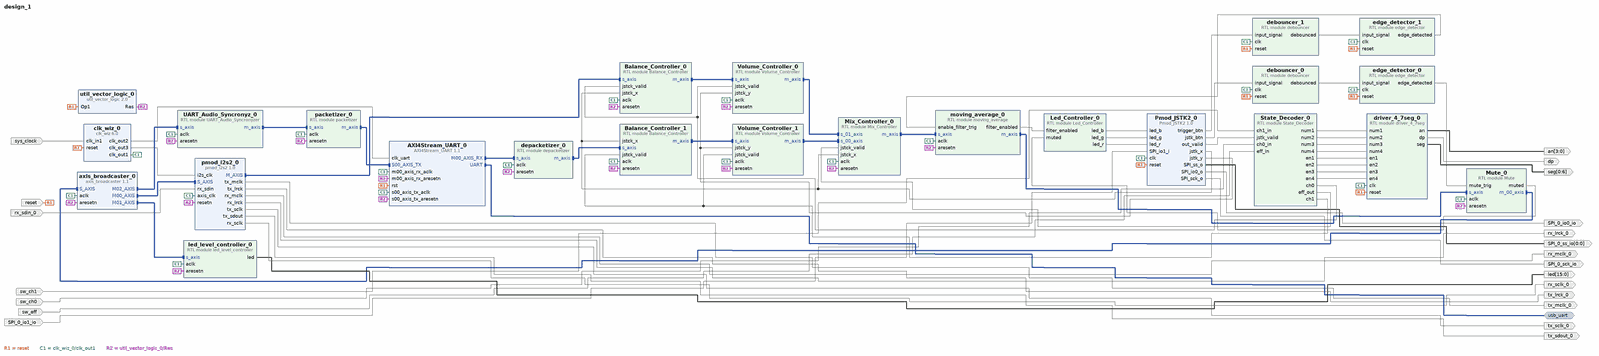
[diagram p0: block diagram of the top level, whole]
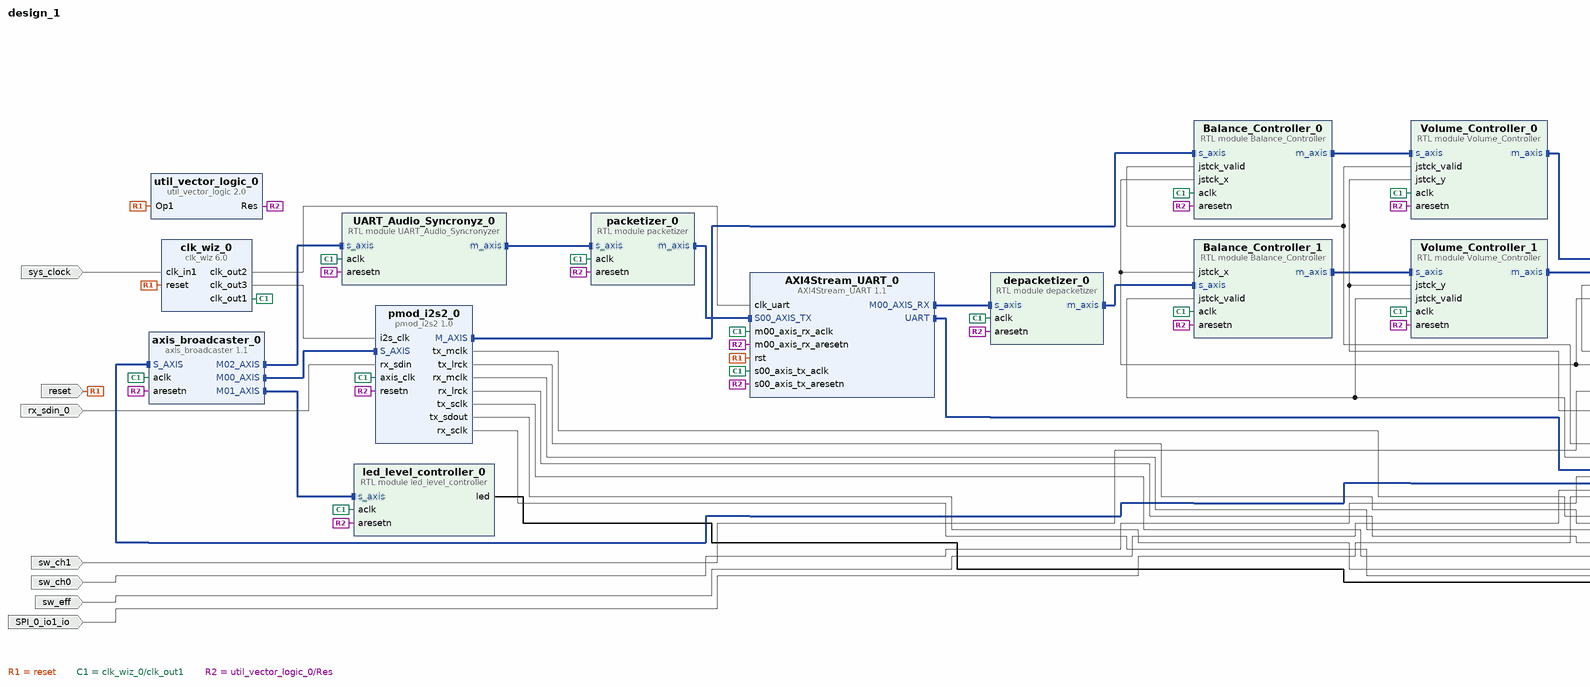
[diagram p1: block diagram of the top level, left part]
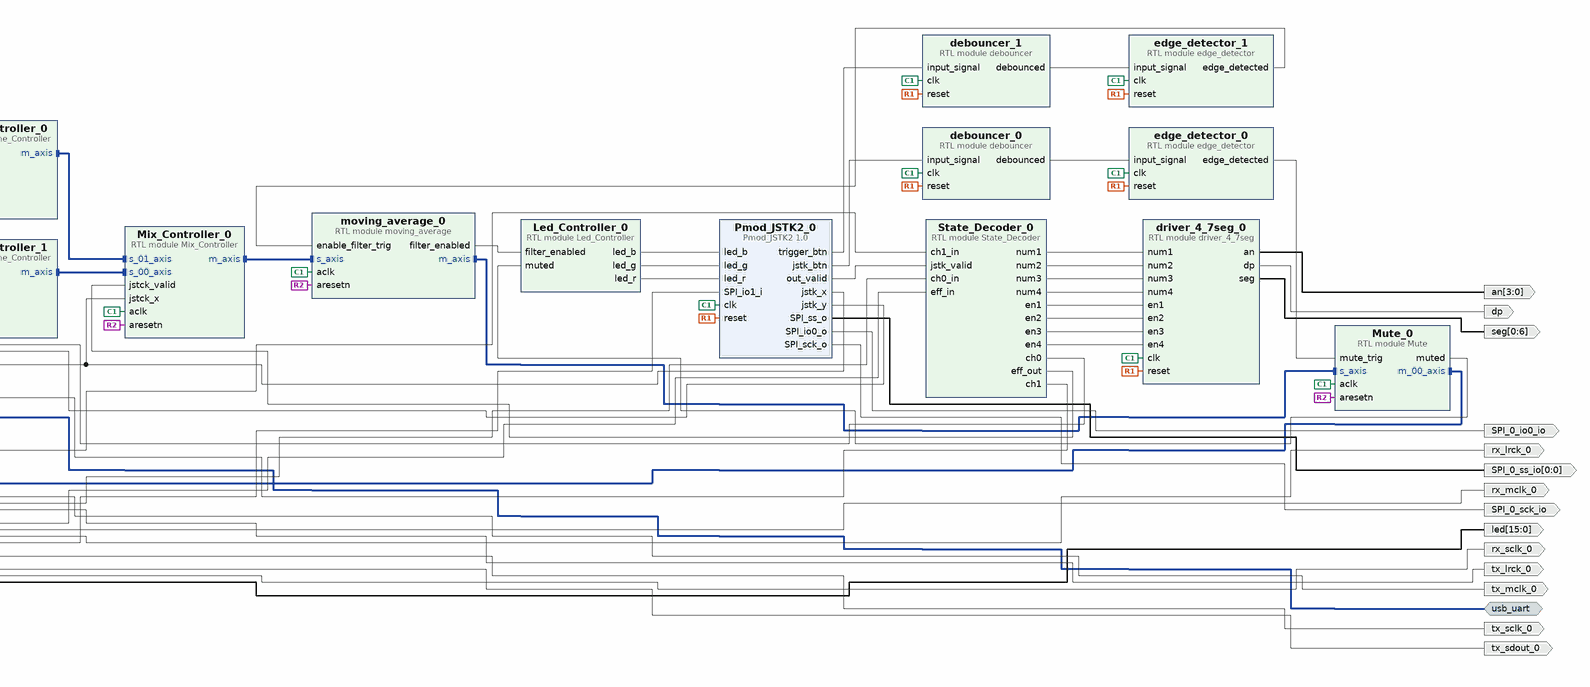
[diagram p2: block diagram of the top level, right part]
# Vivado block design design_1, xc7a35tcpg236-1, Vivado 2020.2
create_bd_design design_1

create_bd_intf_port -mode Master -vlnv xilinx.com:interface:uart_rtl:1.0 usb_uart
create_bd_port -dir I -type clk sys_clock
set_property -dict {CONFIG.FREQ_HZ 100000000 CONFIG.PHASE 0.000} [get_bd_ports sys_clock]
create_bd_port -dir I -type rst reset
set_property -dict {CONFIG.POLARITY ACTIVE_HIGH} [get_bd_ports reset]
create_bd_port -dir I sw_ch1
create_bd_port -dir I sw_ch0
create_bd_port -dir I sw_eff
create_bd_port -dir O -from 0 -to 6 seg
create_bd_port -dir O -from 3 -to 0 an
create_bd_port -dir O dp
create_bd_port -dir O tx_mclk_0
create_bd_port -dir O tx_lrck_0
create_bd_port -dir O rx_mclk_0
create_bd_port -dir O rx_lrck_0
create_bd_port -dir O tx_sclk_0
create_bd_port -dir O tx_sdout_0
create_bd_port -dir O rx_sclk_0
create_bd_port -dir O -from 15 -to 0 led
create_bd_port -dir I rx_sdin_0
create_bd_port -dir O -from 0 -to 0 SPI_0_ss_io
create_bd_port -dir O SPI_0_io0_io
create_bd_port -dir O SPI_0_sck_io
create_bd_port -dir I SPI_0_io1_io

create_bd_cell -type ip -vlnv xilinx.com:ip:clk_wiz:6.0 clk_wiz_0
set_property -dict [list \
  CONFIG.CLKOUT1_JITTER 144.719 \
  CONFIG.CLKOUT1_PHASE_ERROR 114.212 \
  CONFIG.CLKOUT2_JITTER 182.553 \
  CONFIG.CLKOUT2_PHASE_ERROR 114.212 \
  CONFIG.CLKOUT2_REQUESTED_OUT_FREQ 32.000 \
  CONFIG.CLKOUT2_USED true \
  CONFIG.CLKOUT3_JITTER 195.115 \
  CONFIG.CLKOUT3_PHASE_ERROR 114.212 \
  CONFIG.CLKOUT3_REQUESTED_OUT_FREQ 22.591 \
  CONFIG.CLKOUT3_USED true \
  CONFIG.CLK_IN1_BOARD_INTERFACE sys_clock \
  CONFIG.MMCM_CLKFBOUT_MULT_F 8.000 \
  CONFIG.MMCM_CLKOUT0_DIVIDE_F 8.000 \
  CONFIG.MMCM_CLKOUT1_DIVIDE 25 \
  CONFIG.MMCM_CLKOUT2_DIVIDE 35 \
  CONFIG.NUM_OUT_CLKS 3 \
  CONFIG.RESET_BOARD_INTERFACE reset \
  CONFIG.USE_BOARD_FLOW true \
  CONFIG.USE_LOCKED false \
] [get_bd_cells clk_wiz_0]
create_bd_cell -type ip -vlnv xilinx.com:ip:util_vector_logic:2.0 util_vector_logic_0
set_property -dict {CONFIG.C_OPERATION not CONFIG.C_SIZE 1} [get_bd_cells util_vector_logic_0]
create_bd_cell -type module -reference Led_Controller Led_Controller_0
create_bd_cell -type ip -vlnv TimeEngineers:ip:Pmod_JSTK2:1.0 Pmod_JSTK2_0
create_bd_cell -type module -reference moving_average moving_average_0
create_bd_cell -type module -reference edge_detector edge_detector_0
create_bd_cell -type module -reference edge_detector edge_detector_1
create_bd_cell -type module -reference debouncer debouncer_0
create_bd_cell -type module -reference debouncer debouncer_1
create_bd_cell -type module -reference Volume_Controller Volume_Controller_0
create_bd_cell -type module -reference Volume_Controller Volume_Controller_1
create_bd_cell -type module -reference UART_Audio_Syncronyzer UART_Audio_Syncronyz_0
create_bd_cell -type module -reference Mute Mute_0
create_bd_cell -type ip -vlnv xilinx.com:ip:axis_broadcaster:1.1 axis_broadcaster_0
set_property -dict {CONFIG.M02_TDATA_REMAP {tdata[23:0]} CONFIG.NUM_MI 3} [get_bd_cells axis_broadcaster_0]
create_bd_cell -type ip -vlnv DigiLAB:ip:AXI4Stream_UART:1.1 AXI4Stream_UART_0
set_property -dict [list \
  CONFIG.UART_BAUD_RATE 2000000 \
  CONFIG.UART_BOARD_INTERFACE usb_uart \
  CONFIG.USE_BOARD_FLOW true \
] [get_bd_cells AXI4Stream_UART_0]
create_bd_cell -type ip -vlnv TimeEngineers:ip:pmod_i2s2:1.0 pmod_i2s2_0
create_bd_cell -type module -reference Balance_Controller Balance_Controller_0
create_bd_cell -type module -reference Balance_Controller Balance_Controller_1
create_bd_cell -type module -reference packetizer packetizer_0
create_bd_cell -type module -reference depacketizer depacketizer_0
create_bd_cell -type module -reference Mix_Controller Mix_Controller_0
create_bd_cell -type module -reference State_Decoder State_Decoder_0
create_bd_cell -type module -reference driver_4_7seg driver_4_7seg_0
create_bd_cell -type module -reference led_level_controller led_level_controller_0

# ---- connections ----

connect_bd_intf_net [get_bd_intf_pins depacketizer_0/m_axis] [get_bd_intf_pins Balance_Controller_1/s_axis]
connect_bd_intf_net [get_bd_intf_pins Volume_Controller_1/s_axis] [get_bd_intf_pins Balance_Controller_1/m_axis]
connect_bd_intf_net [get_bd_intf_pins Volume_Controller_0/s_axis] [get_bd_intf_pins Balance_Controller_0/m_axis]
connect_bd_intf_net [get_bd_intf_pins pmod_i2s2_0/S_AXIS] [get_bd_intf_pins axis_broadcaster_0/M00_AXIS]
connect_bd_intf_net [get_bd_intf_pins pmod_i2s2_0/M_AXIS] [get_bd_intf_pins Balance_Controller_0/s_axis]
connect_bd_intf_net [get_bd_intf_pins Mix_Controller_0/m_axis] [get_bd_intf_pins moving_average_0/s_axis]
connect_bd_intf_net [get_bd_intf_pins AXI4Stream_UART_0/M00_AXIS_RX] [get_bd_intf_pins depacketizer_0/s_axis]
connect_bd_intf_net [get_bd_intf_pins Mix_Controller_0/s_01_axis] [get_bd_intf_pins Volume_Controller_0/m_axis]
connect_bd_intf_net [get_bd_intf_pins moving_average_0/m_axis] [get_bd_intf_pins Mute_0/s_axis]
connect_bd_intf_net [get_bd_intf_pins axis_broadcaster_0/M02_AXIS] [get_bd_intf_pins UART_Audio_Syncronyz_0/s_axis]
connect_bd_intf_net [get_bd_intf_pins Mute_0/m_00_axis] [get_bd_intf_pins axis_broadcaster_0/S_AXIS]
connect_bd_intf_net [get_bd_intf_pins AXI4Stream_UART_0/S00_AXIS_TX] [get_bd_intf_pins packetizer_0/m_axis]
connect_bd_intf_net [get_bd_intf_pins led_level_controller_0/s_axis] [get_bd_intf_pins axis_broadcaster_0/M01_AXIS]
connect_bd_intf_net [get_bd_intf_pins Mix_Controller_0/s_00_axis] [get_bd_intf_pins Volume_Controller_1/m_axis]
connect_bd_intf_net [get_bd_intf_ports usb_uart] [get_bd_intf_pins AXI4Stream_UART_0/UART]
connect_bd_intf_net [get_bd_intf_pins UART_Audio_Syncronyz_0/m_axis] [get_bd_intf_pins packetizer_0/s_axis]
connect_bd_net [get_bd_ports sys_clock] [get_bd_pins clk_wiz_0/clk_in1]
connect_bd_net [get_bd_ports reset] \
  [get_bd_pins clk_wiz_0/reset] [get_bd_pins util_vector_logic_0/Op1] [get_bd_pins AXI4Stream_UART_0/rst] \
  [get_bd_pins Pmod_JSTK2_0/reset] [get_bd_pins edge_detector_0/reset] [get_bd_pins debouncer_1/reset] \
  [get_bd_pins edge_detector_1/reset] [get_bd_pins debouncer_0/reset] [get_bd_pins driver_4_7seg_0/reset]
connect_bd_net [get_bd_pins clk_wiz_0/clk_out1] \
  [get_bd_pins Pmod_JSTK2_0/clk] [get_bd_pins AXI4Stream_UART_0/m00_axis_rx_aclk] [get_bd_pins debouncer_0/clk] \
  [get_bd_pins debouncer_1/clk] [get_bd_pins edge_detector_0/clk] [get_bd_pins edge_detector_1/clk] \
  [get_bd_pins axis_broadcaster_0/aclk] [get_bd_pins Volume_Controller_1/aclk] [get_bd_pins Volume_Controller_0/aclk] \
  [get_bd_pins Mute_0/aclk] [get_bd_pins moving_average_0/aclk] [get_bd_pins Balance_Controller_0/aclk] \
  [get_bd_pins Balance_Controller_1/aclk] [get_bd_pins UART_Audio_Syncronyz_0/aclk] \
  [get_bd_pins AXI4Stream_UART_0/s00_axis_tx_aclk] [get_bd_pins pmod_i2s2_0/axis_clk] [get_bd_pins packetizer_0/aclk] \
  [get_bd_pins depacketizer_0/aclk] [get_bd_pins Mix_Controller_0/aclk] [get_bd_pins driver_4_7seg_0/clk] \
  [get_bd_pins led_level_controller_0/aclk]
connect_bd_net [get_bd_pins util_vector_logic_0/Res] \
  [get_bd_pins pmod_i2s2_0/resetn] [get_bd_pins AXI4Stream_UART_0/m00_axis_rx_aresetn] \
  [get_bd_pins axis_broadcaster_0/aresetn] [get_bd_pins Volume_Controller_0/aresetn] \
  [get_bd_pins Volume_Controller_1/aresetn] [get_bd_pins Mute_0/aresetn] [get_bd_pins moving_average_0/aresetn] \
  [get_bd_pins Balance_Controller_0/aresetn] [get_bd_pins Balance_Controller_1/aresetn] \
  [get_bd_pins UART_Audio_Syncronyz_0/aresetn] [get_bd_pins AXI4Stream_UART_0/s00_axis_tx_aresetn] \
  [get_bd_pins packetizer_0/aresetn] [get_bd_pins depacketizer_0/aresetn] [get_bd_pins Mix_Controller_0/aresetn] \
  [get_bd_pins led_level_controller_0/aresetn]
connect_bd_net [get_bd_pins Led_Controller_0/led_b] [get_bd_pins Pmod_JSTK2_0/led_b]
connect_bd_net [get_bd_pins Led_Controller_0/led_g] [get_bd_pins Pmod_JSTK2_0/led_g]
connect_bd_net [get_bd_pins Led_Controller_0/led_r] [get_bd_pins Pmod_JSTK2_0/led_r]
connect_bd_net -net ch1_in_0_1 [get_bd_ports sw_ch1] [get_bd_pins State_Decoder_0/ch1_in]
connect_bd_net -net ch0_in_0_1 [get_bd_ports sw_ch0] [get_bd_pins State_Decoder_0/ch0_in]
connect_bd_net -net eff_in_0_1 [get_bd_ports sw_eff] [get_bd_pins State_Decoder_0/eff_in]
connect_bd_net [get_bd_pins State_Decoder_0/num1] [get_bd_pins driver_4_7seg_0/num1]
connect_bd_net [get_bd_pins State_Decoder_0/num2] [get_bd_pins driver_4_7seg_0/num2]
connect_bd_net [get_bd_pins State_Decoder_0/num3] [get_bd_pins driver_4_7seg_0/num3]
connect_bd_net [get_bd_pins State_Decoder_0/num4] [get_bd_pins driver_4_7seg_0/num4]
connect_bd_net [get_bd_pins State_Decoder_0/en1] [get_bd_pins driver_4_7seg_0/en1]
connect_bd_net [get_bd_pins State_Decoder_0/en2] [get_bd_pins driver_4_7seg_0/en2]
connect_bd_net [get_bd_pins State_Decoder_0/en3] [get_bd_pins driver_4_7seg_0/en3]
connect_bd_net [get_bd_pins State_Decoder_0/en4] [get_bd_pins driver_4_7seg_0/en4]
connect_bd_net [get_bd_pins Pmod_JSTK2_0/out_valid] [get_bd_pins State_Decoder_0/jstk_valid]
connect_bd_net [get_bd_pins edge_detector_1/edge_detected] [get_bd_pins moving_average_0/enable_filter_trig]
connect_bd_net [get_bd_pins debouncer_1/debounced] [get_bd_pins edge_detector_1/input_signal]
connect_bd_net [get_bd_pins debouncer_0/debounced] [get_bd_pins edge_detector_0/input_signal]
connect_bd_net [get_bd_pins edge_detector_0/edge_detected] [get_bd_pins Mute_0/mute_trig]
connect_bd_net [get_bd_pins Mute_0/muted] [get_bd_pins Led_Controller_0/muted]
connect_bd_net [get_bd_pins moving_average_0/filter_enabled] [get_bd_pins Led_Controller_0/filter_enabled]
connect_bd_net [get_bd_pins driver_4_7seg_0/seg] [get_bd_ports seg]
connect_bd_net [get_bd_pins driver_4_7seg_0/an] [get_bd_ports an]
connect_bd_net [get_bd_pins driver_4_7seg_0/dp] [get_bd_ports dp]
connect_bd_net [get_bd_pins pmod_i2s2_0/tx_mclk] [get_bd_ports tx_mclk_0]
connect_bd_net [get_bd_pins pmod_i2s2_0/tx_lrck] [get_bd_ports tx_lrck_0]
connect_bd_net [get_bd_pins pmod_i2s2_0/rx_mclk] [get_bd_ports rx_mclk_0]
connect_bd_net [get_bd_pins pmod_i2s2_0/rx_lrck] [get_bd_ports rx_lrck_0]
connect_bd_net [get_bd_pins pmod_i2s2_0/tx_sclk] [get_bd_ports tx_sclk_0]
connect_bd_net [get_bd_pins pmod_i2s2_0/tx_sdout] [get_bd_ports tx_sdout_0]
connect_bd_net [get_bd_pins pmod_i2s2_0/rx_sclk] [get_bd_ports rx_sclk_0]
connect_bd_net [get_bd_pins led_level_controller_0/led] [get_bd_ports led]
connect_bd_net -net rx_sdin_0_1 [get_bd_ports rx_sdin_0] [get_bd_pins pmod_i2s2_0/rx_sdin]
connect_bd_net [get_bd_pins clk_wiz_0/clk_out2] [get_bd_pins AXI4Stream_UART_0/clk_uart]
connect_bd_net [get_bd_pins Pmod_JSTK2_0/jstk_btn] [get_bd_pins debouncer_0/input_signal]
connect_bd_net [get_bd_pins Pmod_JSTK2_0/trigger_btn] [get_bd_pins debouncer_1/input_signal]
connect_bd_net [get_bd_pins Pmod_JSTK2_0/jstk_x] \
  [get_bd_pins Balance_Controller_0/jstck_x] [get_bd_pins Balance_Controller_1/jstck_x] \
  [get_bd_pins Mix_Controller_0/jstck_x]
connect_bd_net [get_bd_pins Pmod_JSTK2_0/jstk_y] [get_bd_pins Volume_Controller_0/jstck_y] [get_bd_pins Volume_Controller_1/jstck_y]
connect_bd_net [get_bd_pins State_Decoder_0/ch0] [get_bd_pins Volume_Controller_0/jstck_valid] [get_bd_pins Balance_Controller_0/jstck_valid]
connect_bd_net [get_bd_pins State_Decoder_0/ch1] [get_bd_pins Volume_Controller_1/jstck_valid] [get_bd_pins Balance_Controller_1/jstck_valid]
connect_bd_net [get_bd_pins State_Decoder_0/eff_out] [get_bd_pins Mix_Controller_0/jstck_valid]
connect_bd_net [get_bd_pins Pmod_JSTK2_0/SPI_ss_o] [get_bd_ports SPI_0_ss_io]
connect_bd_net [get_bd_pins Pmod_JSTK2_0/SPI_io0_o] [get_bd_ports SPI_0_io0_io]
connect_bd_net [get_bd_pins Pmod_JSTK2_0/SPI_sck_o] [get_bd_ports SPI_0_sck_io]
connect_bd_net -net SPI_io1_i_0_1 [get_bd_ports SPI_0_io1_io] [get_bd_pins Pmod_JSTK2_0/SPI_io1_i]
connect_bd_net [get_bd_pins clk_wiz_0/clk_out3] [get_bd_pins pmod_i2s2_0/i2s_clk]

validate_bd_design
save_bd_design
